# Altium schematic sheet RK3576-SMC.PMIC_LDO (0021.0 A0).SchDoc
size 420 x 297 mm; Scale: -; DocumentType: Схема электрическая принципиальная; DocumentGOSTLIt1: ㅤ; DocumentGOSTLIt2: ㅤ; DocumentGOSTLIt3: ㅤ; DocumentGOSTNote: Элементы, отмеченные *, используются при трассировке печатной платы, в состав модуля не включаются; SheetNumber: 5; SheetTotal: 7; DocumentTypeShort: Э3; DocumentInvertoryNumber: ㅤ
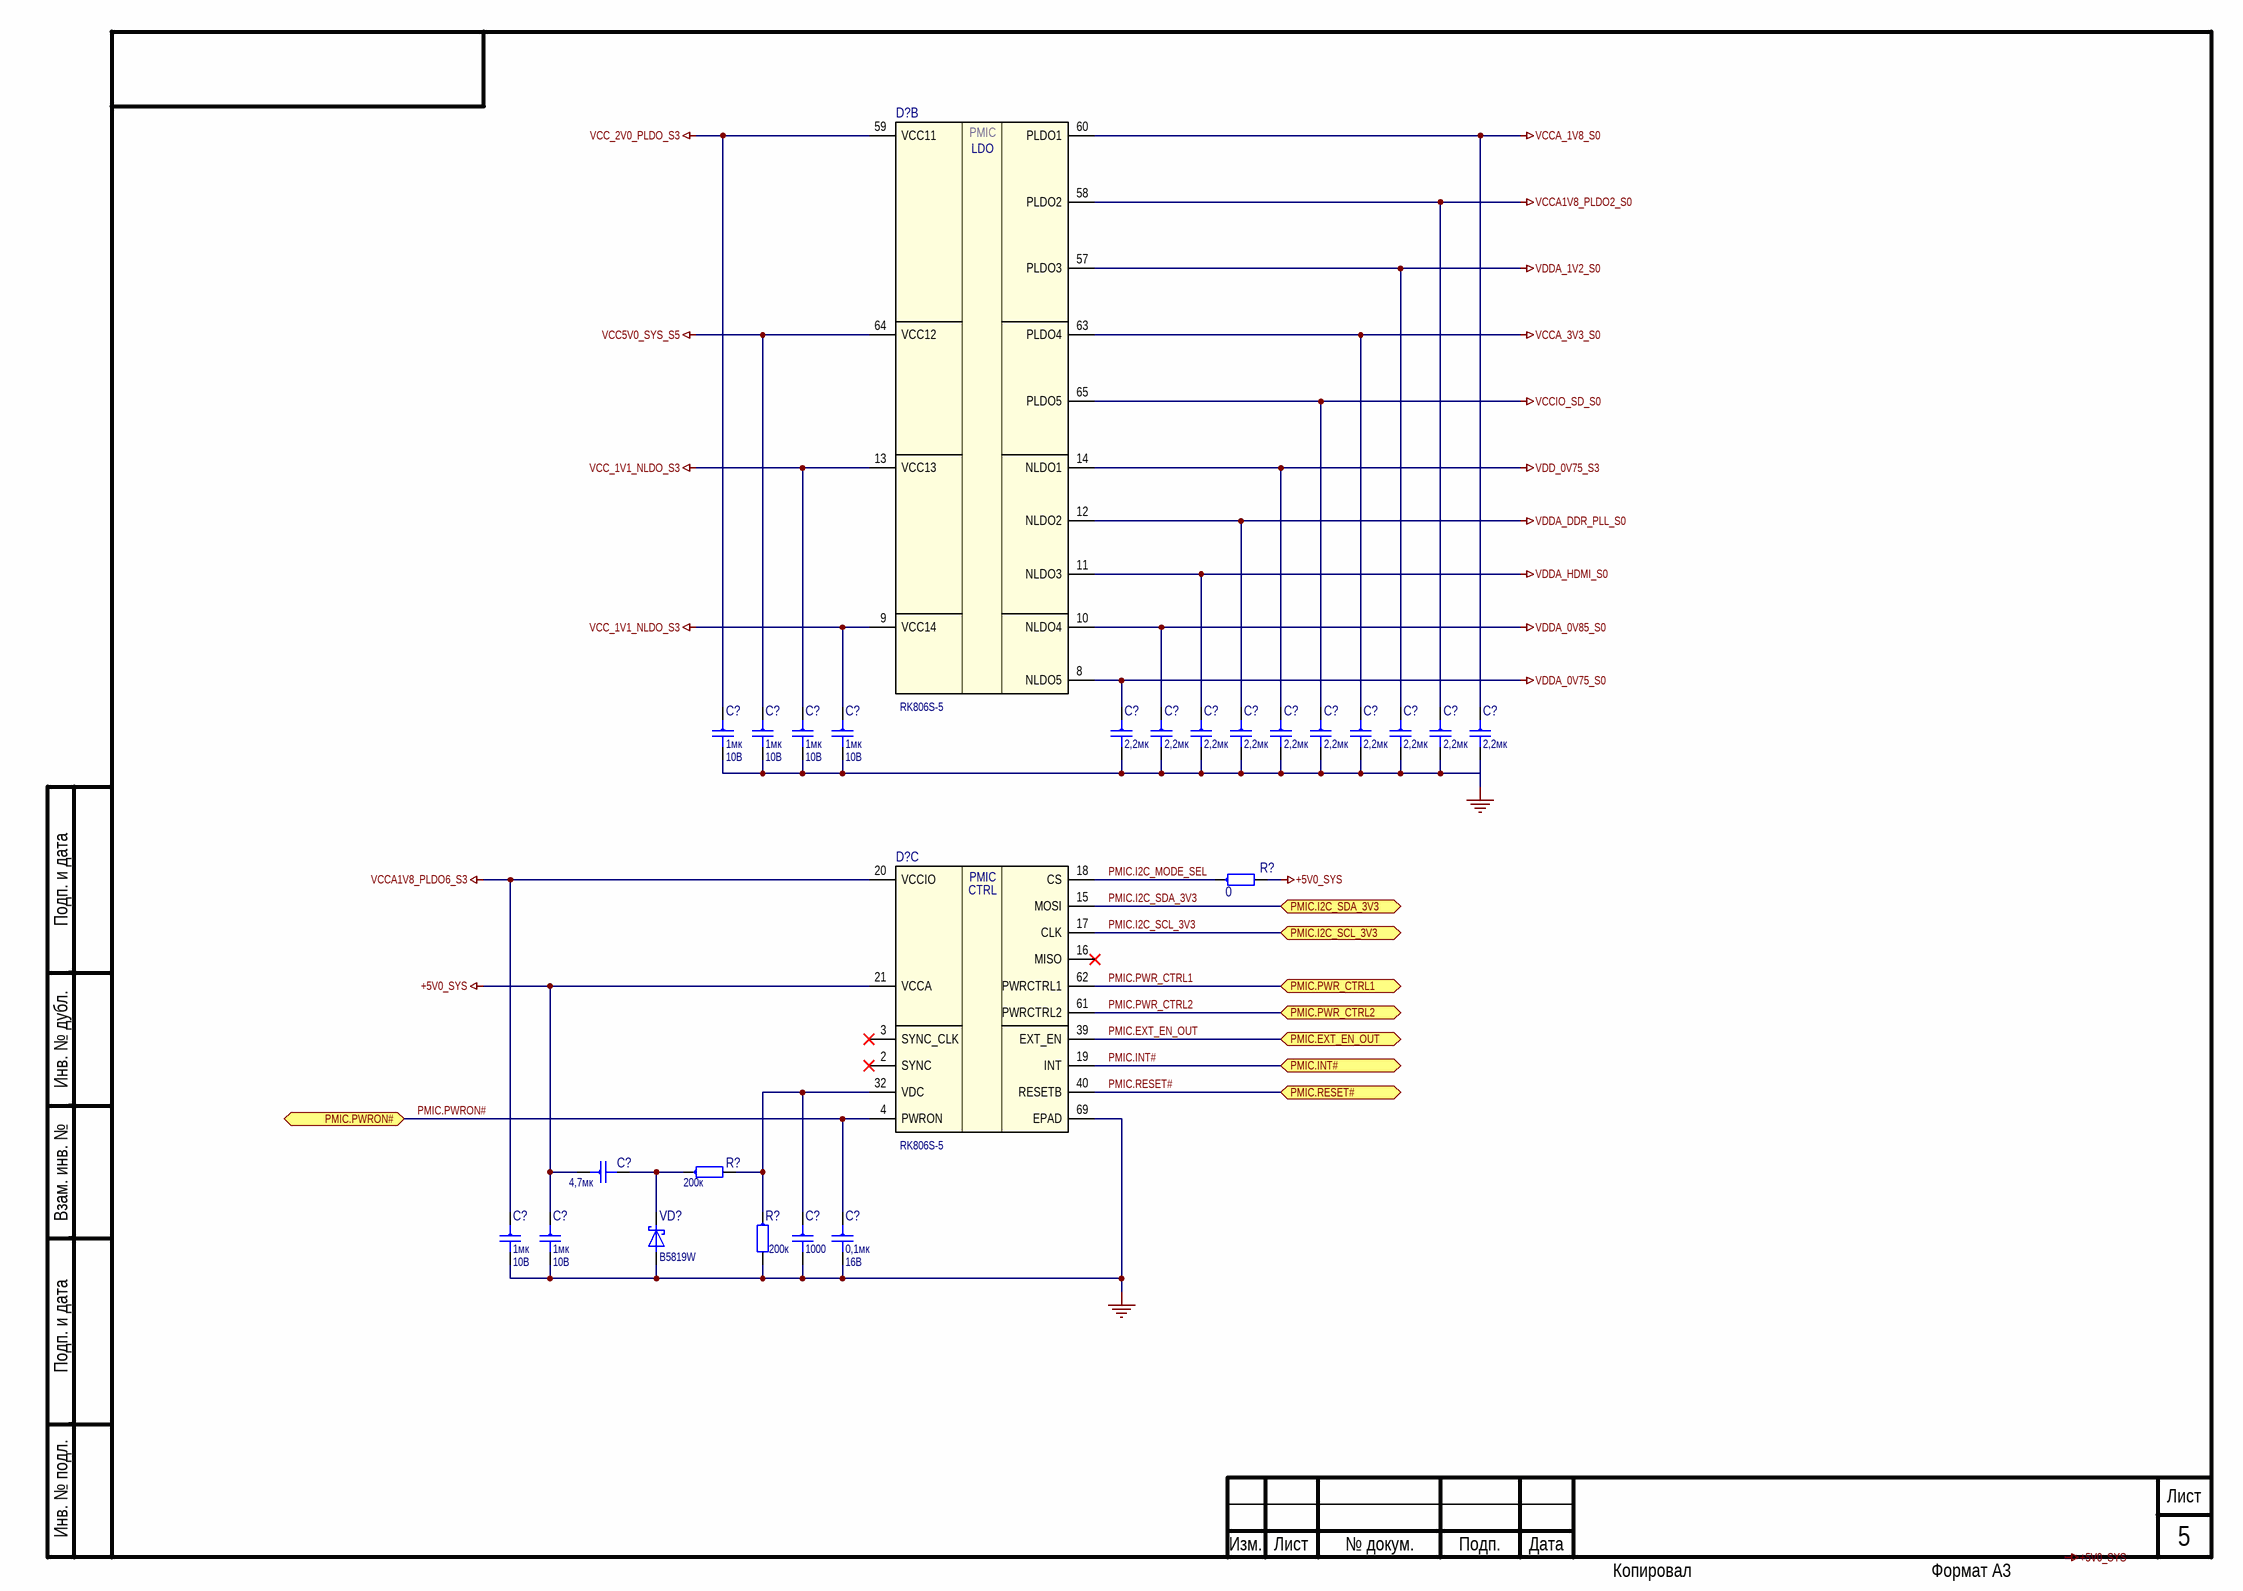
[diagram p0: RK3576-SMC.PMIC_LDO (0021.0 A0).SchDoc]

## Parts
(Parts that share a designator on the sheet are numbered #1, #2 ... from top to bottom, then left to right.)
C?#1  1мк  Напряжение: 10В  [capc1005x55n]
C?#2  1мк  Напряжение: 10В  [capc1005x55n]
C?#3  1мк  Напряжение: 10В  [capc1005x55n]
C?#4  1мк  Напряжение: 10В  [capc1005x55n]
C?#5  2,2мк  [capc1005x55n]
C?#6  2,2мк  [capc1005x55n]
C?#7  2,2мк  [capc1005x55n]
C?#8  2,2мк  [capc1005x55n]
C?#9  2,2мк  [capc1005x55n]
C?#10  2,2мк  [capc1005x55n]
C?#11  2,2мк  [capc1005x55n]
C?#12  2,2мк  [capc1005x55n]
C?#13  2,2мк  [capc1005x55n]
C?#14  2,2мк  [capc1005x55n]
C?#15  4,7мк  [capc1005x65n]
C?#16  1мк  Напряжение: 10В  [capc1005x55n]
C?#17  1мк  Напряжение: 10В  [capc1005x55n]
C?#18  1000  [capc1005x55n]
C?#19  0,1мк  Напряжение: 16В  [capc1005x55n]
D?#1  RK806S-5  [qfn35p700x700x90-69_hsn]  (part B of 3)
D?#2  RK806S-5  [qfn35p700x700x90-69_hsn]  (part C of 3)
R?#1  0  [resc0603x26n]
R?#2  200к  [resc1005x40n]
R?#3  200к  [resc1005x40n]
VD?  B5819W  [sod3716x125n]

## Ports
PMIC.EXT_EN_OUT (bidir), PMIC.I2C_SCL_3V3 (bidir), PMIC.I2C_SDA_3V3 (bidir), PMIC.INT# (bidir), PMIC.PWR_CTRL1 (bidir), PMIC.PWR_CTRL2 (bidir), PMIC.PWRON# (bidir), PMIC.RESET# (bidir)

## Nets
+5V0_SYS: C?#15.1 C?#17.1 D?#2.21(VCCA) R?#1.2
SOM.GND: C?#1.2 C?#2.2 C?#3.2 C?#4.2 C?#5.2 C?#6.2 C?#7.2 C?#8.2 C?#9.2 C?#10.2 C?#11.2 C?#12.2 C?#13.2 C?#14.2 C?#16.2 C?#17.2 C?#18.2 C?#19.2 D?#2.69(EPAD) R?#3.2 VD?.2
VCC5V0_SYS_S5: C?#2.1 D?#1.64(VCC12)
VCC_1V1_NLDO_S3: C?#3.1 C?#4.1 D?#1.9(VCC14) D?#1.13(VCC13)
VCC_2V0_PLDO_S3: C?#1.1 D?#1.59(VCC11)
VCCA1V8_PLDO2_S0: C?#13.1 D?#1.58(PLDO2)
VCCA1V8_PLDO6_S3: C?#16.1 D?#2.20(VCCIO)
VCCA_1V8_S0: C?#14.1 D?#1.60(PLDO1)
VCCA_3V3_S0: C?#11.1 D?#1.63(PLDO4)
VCCIO_SD_S0: C?#10.1 D?#1.65(PLDO5)
VDD_0V75_S3: C?#9.1 D?#1.14(NLDO1)
VDDA_0V75_S0: C?#5.1 D?#1.8(NLDO5)
VDDA_0V85_S0: C?#6.1 D?#1.10(NLDO4)
VDDA_1V2_S0: C?#12.1 D?#1.57(PLDO3)
VDDA_DDR_PLL_S0: C?#8.1 D?#1.12(NLDO2)
VDDA_HDMI_S0: C?#7.1 D?#1.11(NLDO3)
PMIC.EXT_EN_OUT: D?#2.39(EXT_EN) ; port PMIC.EXT_EN_OUT
PMIC.I2C_MODE_SEL: D?#2.18(CS) R?#1.1
PMIC.I2C_SCL_3V3: D?#2.17(CLK) ; port PMIC.I2C_SCL_3V3
PMIC.I2C_SDA_3V3: D?#2.15(MOSI) ; port PMIC.I2C_SDA_3V3
PMIC.INT#: D?#2.19(INT) ; port PMIC.INT#
PMIC.PWR_CTRL1: D?#2.62(PWRCTRL1) ; port PMIC.PWR_CTRL1
PMIC.PWR_CTRL2: D?#2.61(PWRCTRL2) ; port PMIC.PWR_CTRL2
PMIC.PWRON#: C?#19.1 D?#2.4(PWRON) ; port PMIC.PWRON#
PMIC.RESET#: D?#2.40(RESETB) ; port PMIC.RESET#
NetC?#15_2: C?#15.2 R?#2.1 VD?.1
NetC?#18_1: C?#18.1 D?#2.32(VDC) R?#2.2 R?#3.1

Not connected (* = marked no-connect by the designer): D?#2 2(SYNC)* 3(SYNC_CLK)* 16(MISO)*

## Notes on the sheet
- Labels drawn without touching a wire or pin: +5V0_SYS
- Подп. и дата
- Инв. № дубл.
- Взам. инв. №
- Инв. № подл.
- Изм.
- Лист
- № докум.
- Подп.
- Дата
- Копировал
- Формат А3
- (in symbol RK806S-5, part B) PMIC; LDO
- (in symbol RK806S-5, part C) PMIC; CTRL

## Library data of the parts
C?#1-C?#4 C?#16 C?#17 = CC0402KRX5R6BB105: Part_ID: ATB-00690; Manufacturer: Yageo; Schematic_Part: C_min_val,C_min,C_val,C; Тип ЭКБ: Конденсаторы; Наименование: 0402-X5R-10V-1uF±10%; Тип компонента: Конденсатор керамический; Value: 1uF; Voltage: 10V; Температура: -55 +85; PCB_Footprint: capc1005x55,capc1005x55n; Тип корпуса: Chip; Видоразмер: 1005; Вариант установки: Поверхностный; Код ERP: E2-00028722; Photo: Photos\Photos\Yageo_Capacitors.jpg; Автор: Чепиков И.В.; Точность: 10%; Device: 0402-X5R-10V-1uF±10%_Yageo; Library Ref 2: C; Library Ref 3: Cshort; Part Number: CC0402KRX5R6BB105; Datasheet: Datasheets\Capacitors\UPY-GPHC_X5R_4V-to-50V_30.pdf; Номинал: 1мк; Part_Number: CC0402KRX5R6BB105; Height: 0.55; Производитель: Yageo; Website: https://www.yageo.com/upload/media/product/productsearch/datasheet/mlcc/UPY-GPHC_X5R_4V-to-50V_30.pdf; Дата: 23.09.2024; ComponentLink1Description: UPY-GPHC_X5R_4V-to-50V_30.pdf; ComponentLink1URL: https://www.yageo.com/upload/media/product/productsearch/datasheet/mlcc/UPY-GPHC_X5R_4V-to-50V_30.pdf; NameFromManufacturer: CC0402KRX5R6BB105; Original PN: CC0402KRX5R6BB105
C?#5-C?#14 = CC0402KRX5R5BB225: Part_ID: ATB-01027; Manufacturer: Yageo; Schematic_Part: C_min_val,C_min,C_val,C; Тип ЭКБ: Конденсаторы; Наименование: 0402-X5R-6.3V-2.2uF±10%; Тип компонента: Конденсатор керамический; Value: 2.2uF; Напряжение: 6,3В; Voltage: 6.3V; Температура: -55 +85; PCB_Footprint: capc1005x55,capc1005x55n; Тип корпуса: Chip; Видоразмер: 1005; Вариант установки: Поверхностный; Код ERP: E2-00010605; Photo: Photos\Photos\Yageo_Capacitors.jpg; Автор: Чепиков И.В.; Точность: 10%; Device: 0402-X5R-6.3V-2.2uF±10%_Yageo; Library Ref 2: C; Library Ref 3: Cshort; Part Number: CC0402KRX5R5BB225; Datasheet: Datasheets\Capacitors\UPY-GPHC_X5R_4V-to-50V_30.pdf; Номинал: 2,2мк; Part_Number: CC0402KRX5R5BB225; Height: 0.55; Производитель: Yageo; Website: https://www.yageo.com/upload/media/product/productsearch/datasheet/mlcc/UPY-GPHC_X5R_4V-to-50V_30.pdf; Дата: 25.09.2024; ComponentLink1Description: UPY-GPHC_X5R_4V-to-50V_30.pdf; ComponentLink1URL: https://www.yageo.com/upload/media/product/productsearch/datasheet/mlcc/UPY-GPHC_X5R_4V-to-50V_30.pdf; NameFromManufacturer: CC0402KRX5R5BB225; Original PN: CC0402KRX5R5BB225
C?#15 = CC0402KRX5R6BB475: Part_ID: ATB-01272; Manufacturer: Yageo; Schematic_Part: C_min_val,C_min,C_val,C; Тип ЭКБ: Конденсаторы; Наименование: 0402-X5R-10V-4.7uF±10%; Тип компонента: Конденсатор керамический; Value: 4.7uF; Напряжение: 10В; Voltage: 10V; Температура: -55 +85; Тип корпуса: Chip; Видоразмер: 1005; Вариант установки: Поверхностный; Код ERP: E2-00034571; Photo: Photos\Photos\Yageo_Capacitors.jpg; Автор: Чепиков И.В.; Точность: 10%; Device: 0402-X5R-10V-4.7uF±10%_Yageo; Library Ref 2: C; Library Ref 3: Cshort; Part Number: CC0402KRX5R6BB475; Datasheet: Datasheets\Capacitors\UPY-GPHC_X5R_4V-to-50V_30.pdf; Номинал: 4,7мк; Part_Number: CC0402KRX5R6BB475; PCB_Footprint: capc1005x65n; Height: 0.65; Производитель: Yageo; Website: https://www.yageo.com/upload/media/product/productsearch/datasheet/mlcc/UPY-GPHC_X5R_4V-to-50V_30.pdf; Дата: 09.10.2024; ComponentLink1Description: UPY-GPHC_X5R_4V-to-50V_30.pdf; ComponentLink1URL: https://www.yageo.com/upload/media/product/productsearch/datasheet/mlcc/UPY-GPHC_X5R_4V-to-50V_30.pdf; NameFromManufacturer: CC0402KRX5R6BB475; Original PN: CC0402KRX5R6BB475
C?#18 = CC0402JRNPO9BN102: Part_ID: ATB-03443; Manufacturer: Yageo; Schematic_Part: C_min_val,C_min,C_val,C; Тип ЭКБ: Конденсаторы; Наименование: 0402-NP0-50V-1nF±5%; Тип компонента: Конденсатор керамический; Value: 1nF; Напряжение: 50В; Voltage: 50V; Температура: -55 +125; PCB_Footprint: capc1005x55,capc1005x55n; Тип корпуса: Chip; Видоразмер: 1005; Вариант установки: Поверхностный; Photo: Photos\Photos\Yageo_Capacitors.jpg; Автор: Чепиков И.В.; Точность: 5%; Device: 0402-NP0-50V-1nF±5%_Yageo; Library Ref 2: C; Library Ref 3: Cshort; Part Number: CC0402JRNPO9BN102; Datasheet: Datasheets\Capacitors\UPY-GP_NP0_16V-to-250V_19.pdf; Номинал: 1000; Part_Number: CC0402JRNPO9BN102; Height: 0.55; Производитель: Yageo; Website: https://www.yageo.com/upload/media/product/productsearch/datasheet/mlcc/UPY-GP_NP0_16V-to-250V_19.pdf; Дата: 15.10.2024; ComponentLink1Description: UPY-GP_NP0_16V-to-250V_19.pdf; ComponentLink1URL: https://www.yageo.com/upload/media/product/productsearch/datasheet/mlcc/UPY-GP_NP0_16V-to-250V_19.pdf; NameFromManufacturer: CC0402JRNPO9BN102; Original PN: CC0402JRNPO9BN102
C?#19 = CC0402KRX7R7BB104: Part_ID: ATB-02516; Manufacturer: Yageo; Schematic_Part: C_min_val,C_min,C_val,C; Тип ЭКБ: Конденсаторы; Наименование: 0402-X7R-16V-100nF±10%; Тип компонента: Конденсатор керамический; Value: 100nF; Voltage: 16V; Температура: -55 +125; PCB_Footprint: capc1005x55,capc1005x55n; Тип корпуса: Chip; Видоразмер: 1005; Вариант установки: Поверхностный; Код ERP: E2-00028731; Photo: Photos\Photos\Yageo_Capacitors.jpg; Автор: Чепиков И.В.; Точность: 10%; Device: 0402-X7R-16V-100nF±10%_Yageo; Library Ref 2: C; Library Ref 3: Cshort; Part Number: CC0402KRX7R7BB104; Datasheet: Datasheets\Capacitors\UPY-GPHC_X7R_6.3V-to-250V_23.pdf; Номинал: 0,1мк; Part_Number: CC0402KRX7R7BB104; Height: 0.55; Производитель: Yageo; Website: https://www.yageo.com/upload/media/product/productsearch/datasheet/mlcc/UPY-GPHC_X7R_6.3V-to-250V_23.pdf; Дата: 10.10.2024; ComponentLink1Description: UPY-GPHC_X7R_6.3V-to-250V_23.pdf; ComponentLink1URL: https://www.yageo.com/upload/media/product/productsearch/datasheet/mlcc/UPY-GPHC_X7R_6.3V-to-250V_23.pdf; NameFromManufacturer: CC0402KRX7R7BB104; Original PN: CC0402KRX7R7BB104
D?#1 D?#2 = RK806S-5: Power-management integrated circuit; Part_ID: ATB-08063; Manufacturer: Rockchip; Тип ЭКБ: Микросхемы; Тип компонента: Контроллеры; Voltage: 2.7 - 5.5; Температура: -40 +125; Тип корпуса: QFN7x7-68; Вариант установки: Поверхностный; Photo: Photos\Photos\Rockchip_RK806-1.jpg; Автор: Чепиков И.В.; Part Number: RK806S-5; Наименование: RK806S-5; Datasheet: Datasheets\Microcircuits\Rockchip_RK806S_Datasheet_V1.5.pdf; Schematic_Part: RK806-1; Value: RK806S-5; Part_Number: RK806S-5; PCB_Footprint: qfn35p700x700x90-69_hsn; Height: 0.9; Производитель: Rockchip; Дата: 16.09.2025; Device: RK806S-5; ComponentLink1Description: Rockchip_RK806S_Datasheet_V1.5.pdf; NameFromManufacturer: RK806S-5; Original PN: RK806S-5
R?#1 = RC0201JR-070RL: Резисторы (chip) общего назначения; Part_ID: ATB-09733; Manufacturer: Yageo; Schematic_Part: R_min_val,R_min,R_val,R; Наименование: 0201-0.05W-0±5%; Voltage: 30V; Power: 0.05; Точность: ±5%; Температура: -55 +125; Вариант установки: Поверхностный; Код ERP: E2-00008416; Photo: Photos\Photos\Yageo_RC0075-RC2512.jpg; Автор: Чепиков И.В.; Device: 0201-0.05W-0±5%_Yageo; Library Ref 2: R; Part Number: RC0201JR-070RL; Тип ЭКБ: Резисторы; Datasheet: Datasheets\Resistors\PYu-RC_Group_51_RoHS_L_12.pdf; Тип компонента: Резистор; Номинал: 0; Value: 0; Part_Number: RC0201JR-070RL; PCB_Footprint: resc0603x26n; Тип корпуса: Chip; Height: 0.26; Производитель: Yageo; Website: https://www.yageo.com/upload/media/product/products/datasheet/rchip/PYu-RC_Group_51_RoHS_L_12.pdf; Дата: 14.01.2025; NameFromManufacturer: RC0201JR-070RL; ComponentLink1URL: https://www.yageo.com/upload/media/product/products/datasheet/rchip/PYu-RC_Group_51_RoHS_L_12.pdf; ComponentLink1Description: PYu-RC_Group_51_RoHS_L_12.pdf; Original PN: RC0201JR-070RL
R?#2 R?#3 = RC0402FR-07200KL: Резисторы (chip) общего назначения; Part_ID: ATB-00839; Manufacturer: Yageo; Schematic_Part: R_min_val,R_min,R_val,R; Наименование: 0402-0.063W-200K-100ppm±1%; Value: 200k; Voltage: 50V; Power: 0.063; Точность: ±1%; ТКС (от  -60 до +20 град): ± 100; Ряд: E24; Температура: -55 +155; Вариант установки: Поверхностный; Код ERP: E2-00028775; Photo: Photos\Photos\Yageo_RC0075-RC2512.jpg; Автор: Чепиков И.В.; Device: 0402-0.063W-200K-100ppm±1%_Yageo; Library Ref 2: R; Part Number: RC0402FR-07200KL; Тип ЭКБ: Резисторы; Datasheet: Datasheets\Resistors\PYu-RC_Group_51_RoHS_L_12.pdf; Тип компонента: Резистор; Номинал: 200к; ТКС (от +20 град до max): ± 100; Part_Number: RC0402FR-07200KL; PCB_Footprint: resc1005x40n; Тип корпуса: Chip; Height: 0.4; Производитель: Yageo; Website: https://www.yageo.com/upload/media/product/products/datasheet/rchip/PYu-RC_Group_51_RoHS_L_12.pdf; Дата: 25.09.2024; NameFromManufacturer: RC0402FR-07200KL; ComponentLink1URL: https://www.yageo.com/upload/media/product/products/datasheet/rchip/PYu-RC_Group_51_RoHS_L_12.pdf; ComponentLink1Description: PYu-RC_Group_51_RoHS_L_12.pdf; Original PN: RC0402FR-07200KL
VD? = B5819W: Schottky; VRRM=40V, VF=600(900)mV, IF=1(3)A, IR=1mA, CD=120pF; Part_ID: ATB-00135; Manufacturer: SMC; Schematic_Part: VD_sch_min,VD_sch; Тип ЭКБ: Диоды; Тип компонента: Диод Шоттки; Температура: -55 +150; Тип корпуса: SOD123; Вариант установки: Поверхностный; Код ERP: E2-00013594; Photo: Photos\Photos\SMC_B5819W.jpg; Автор: Чепиков И.В.; Library Ref 2: VDsch; Part Number: B5819W; Наименование: B5819W; Datasheet: Datasheets\Diodes\B5817W-B5819W.pdf; Value: B5819W; Part_Number: B5819W; PCB_Footprint: sod3716x125n; Height: 1.25; Weight: 0.01; Производитель: SMC; Website: https://www.smc-diodes.com/Products/Discrete/Schottky-Rectifiers/B5819W.html; Дата: 03.04.2024; Device: B5819W; ComponentLink1Description: B5817W-B5819W.pdf; ComponentLink1URL: https://www.smc-Diodes.com/Products/Discrete/Schottky-Rectifiers/B5819W.html; NameFromManufacturer: B5819W; Original PN: B5819W